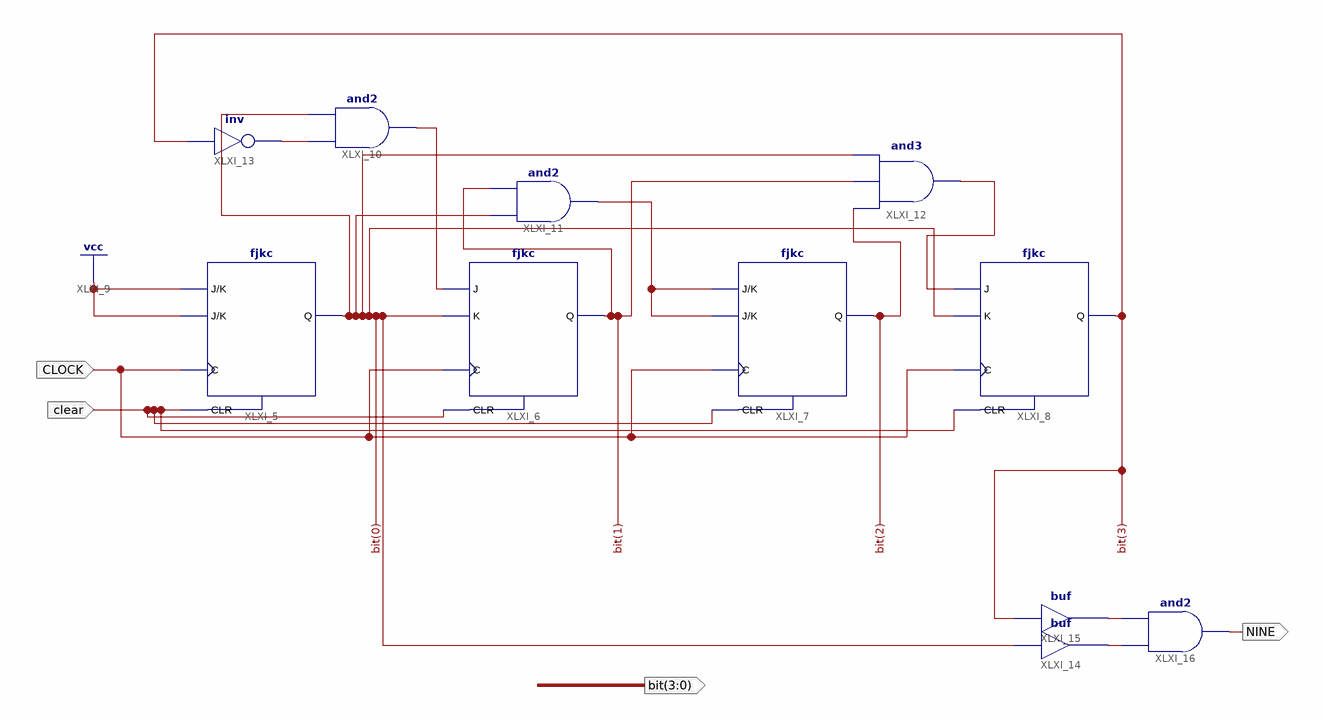
[diagram p0: schematic sheet 1]
// Xilinx ISE schematic counter09.sch (spartan6) as structural Verilog: 11 symbols, 4 ports
module counter09 (
  input  CLOCK,
  input  clear,
  output [3:0] \bit ,
  output NINE
);

  wire XLXN_6, XLXN_11, XLXN_22, XLXN_26, XLXN_27, XLXN_28;

  fjkc XLXI_5 (.C(CLOCK), .CLR(clear), .J(1'b1), .K(1'b1), .Q(\bit [0]));
  fjkc XLXI_6 (.C(CLOCK), .CLR(clear), .J(XLXN_11), .K(\bit [0]), .Q(\bit [1]));
  fjkc XLXI_7 (.C(CLOCK), .CLR(clear), .J(XLXN_22), .K(XLXN_22), .Q(\bit [2]));
  fjkc XLXI_8 (.C(CLOCK), .CLR(clear), .J(XLXN_26), .K(\bit [0]), .Q(\bit [3]));
  and XLXI_10 (XLXN_11, XLXN_6, \bit [0]);
  and XLXI_11 (XLXN_22, \bit [0], \bit [1]);
  and XLXI_12 (XLXN_26, \bit [2], \bit [1], \bit [0]);
  not XLXI_13 (XLXN_6, \bit [3]);
  buf XLXI_14 (XLXN_27, \bit [0]);
  buf XLXI_15 (XLXN_28, \bit [3]);
  and XLXI_16 (NINE, XLXN_27, XLXN_28);

  // Notes on the sheet:
  //   CLOCK_DEDICATED_ROUTE on signal CLOCK = TRUE
endmodule
